# EAGLE design controller (EAGLE 4.11)
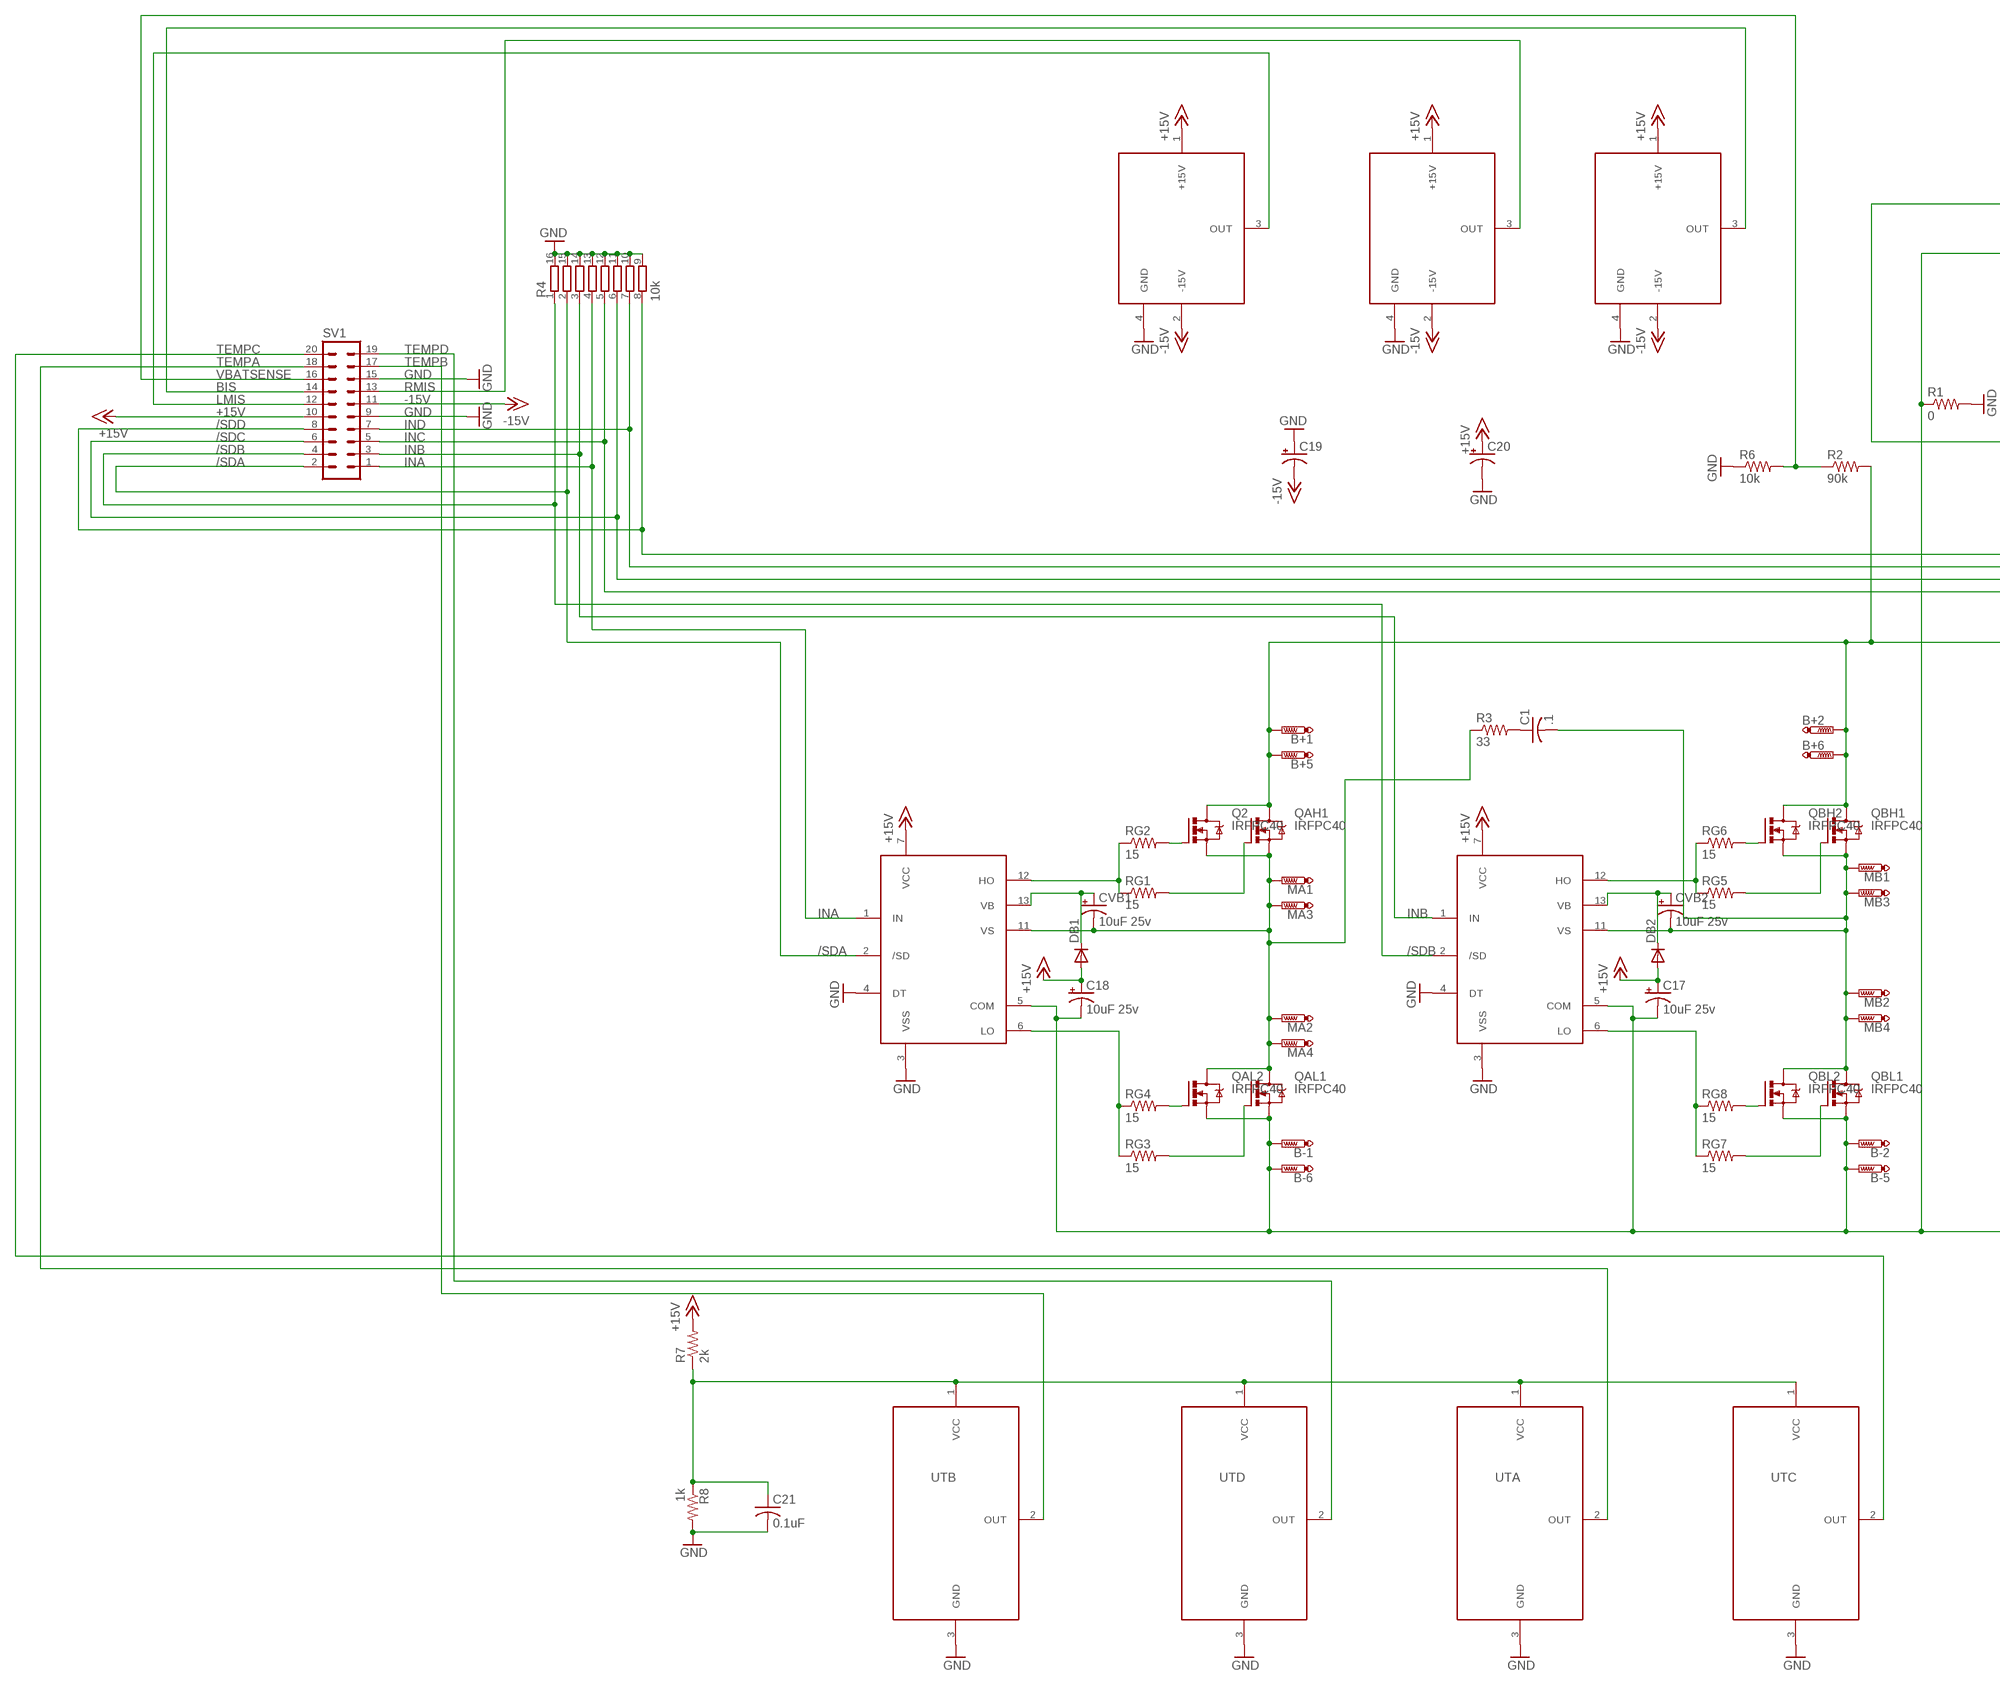
[diagram p0: schematic, sheet 1, part 1 of 2]
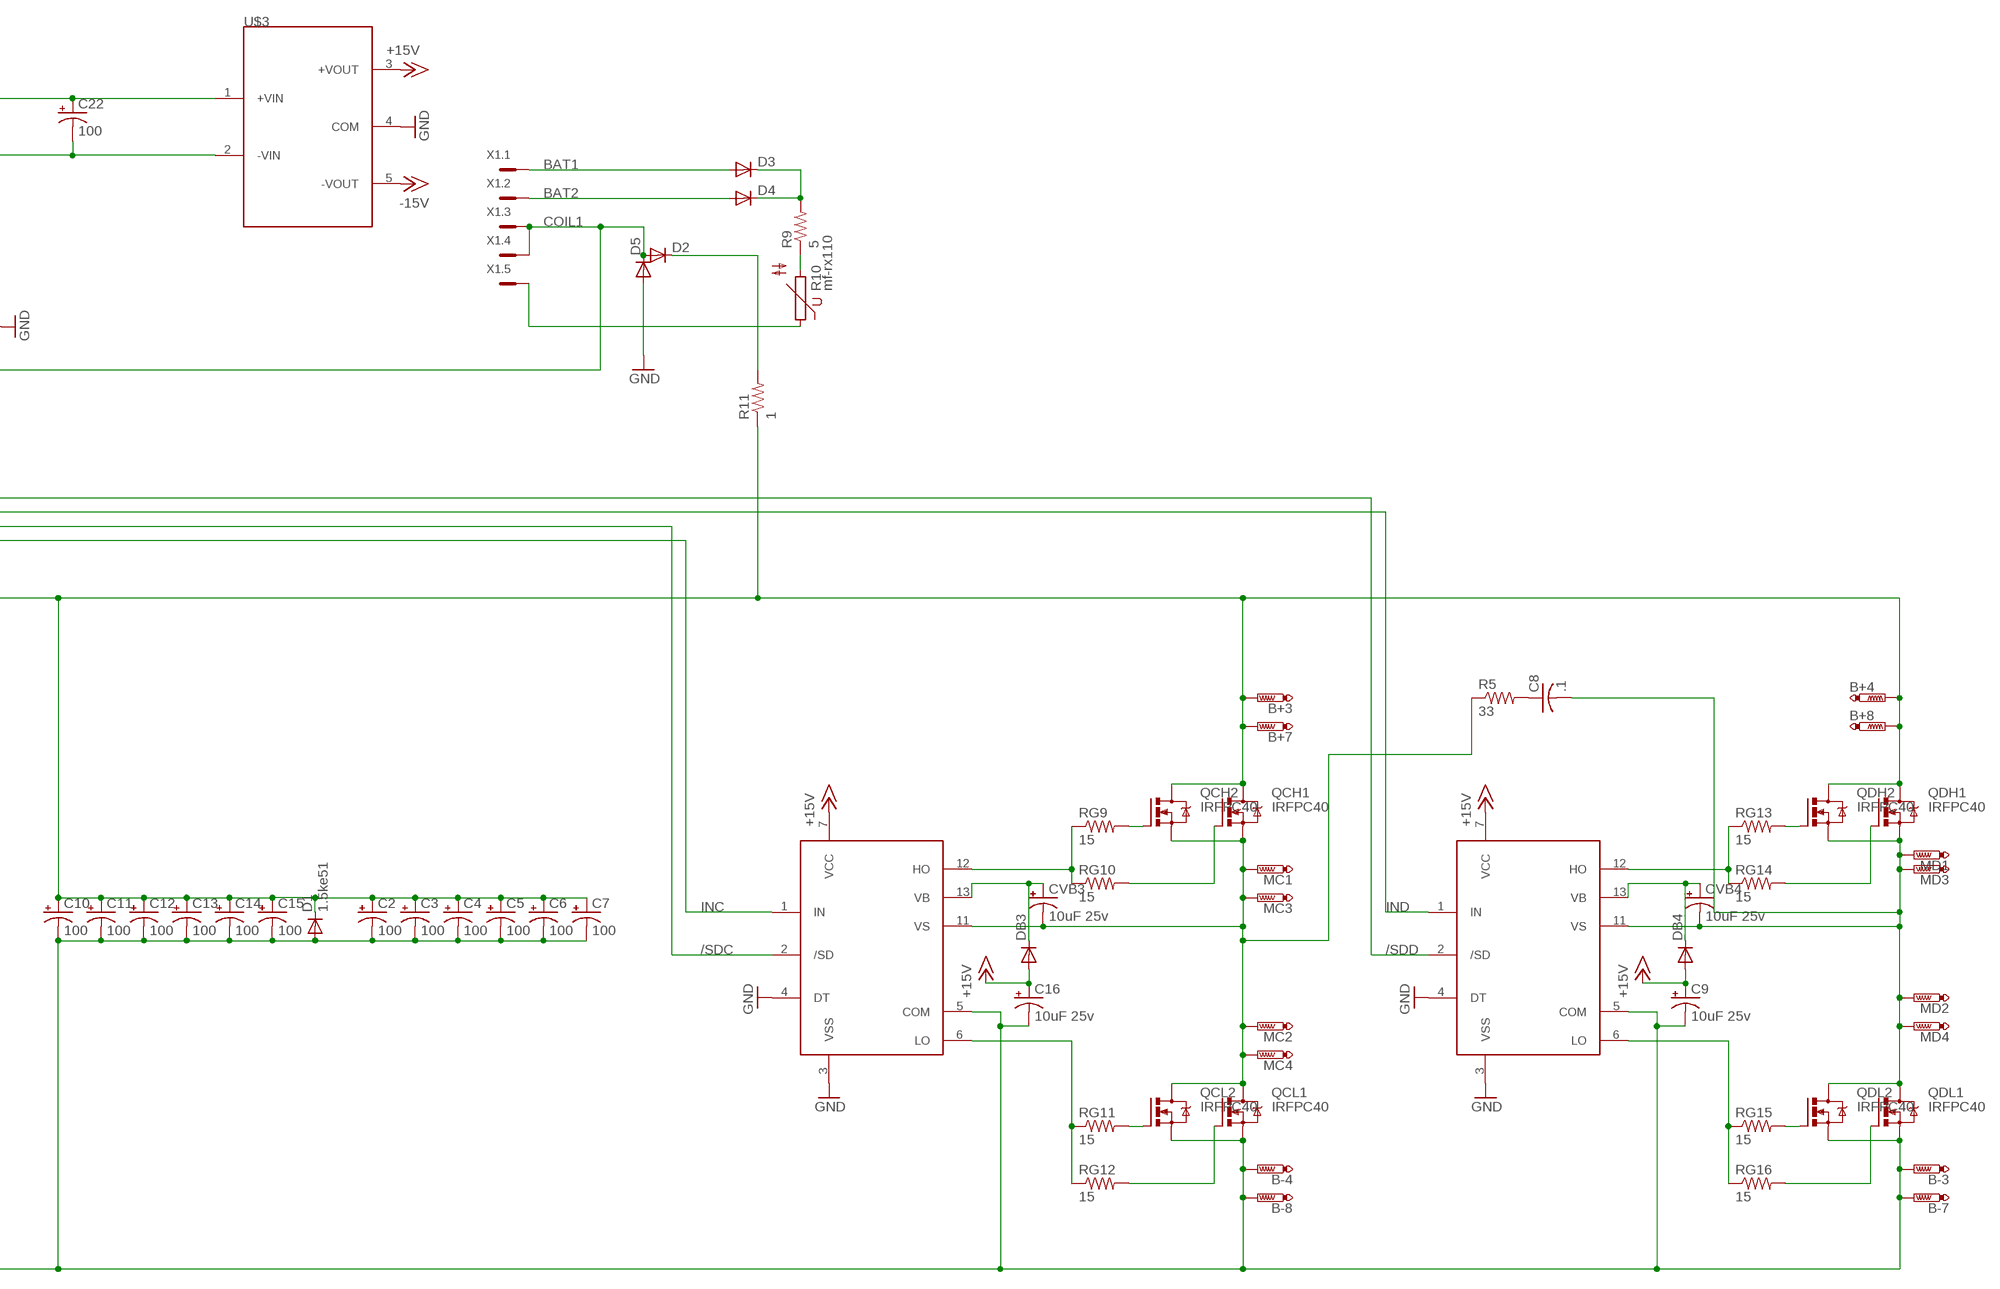
[diagram p1: schematic, sheet 1, part 2 of 2]

## Parts
B+1  PTR1PAD1-17Y  [P1-17Y]
B+2  PTR1PAD1-17Y  [P1-17Y]
B+3  PTR1PAD1-17Y  [P1-17Y]
B+4  PTR1PAD1-17Y  [P1-17Y]
B+5  PTR1PAD1-17Y  [P1-17Y]
B+6  PTR1PAD1-17Y  [P1-17Y]
B+7  PTR1PAD1-17Y  [P1-17Y]
B+8  PTR1PAD1-17Y  [P1-17Y]
B-1  PTR1PAD1-17Y  [P1-17Y]
B-2  PTR1PAD1-17Y  [P1-17Y]
B-3  PTR1PAD1-17Y  [P1-17Y]
B-4  PTR1PAD1-17Y  [P1-17Y]
B-5  PTR1PAD1-17Y  [P1-17Y]
B-6  PTR1PAD1-17Y  [P1-17Y]
B-7  PTR1PAD1-17Y  [P1-17Y]
B-8  PTR1PAD1-17Y  [P1-17Y]
C1  .1  C-US050-050X075  [C050-050X075]
C2  100  CPOL-USE2.5-7  [E2,5-7]
C3  100  CPOL-USE2.5-7  [E2,5-7]
C4  100  CPOL-USE2.5-7  [E2,5-7]
C5  100  CPOL-USE2.5-7  [E2,5-7]
C6  100  CPOL-USE2.5-7  [E2,5-7]
C7  100  CPOL-USE2.5-7  [E2,5-7]
C8  .1  C-US050-050X075  [C050-050X075]
C9  10uF 25v  CPOL-USC/6032-28R  [C/6032-28R]
C10  100  CPOL-USE2.5-7  [E2,5-7]
C11  100  CPOL-USE2.5-7  [E2,5-7]
C12  100  CPOL-USE2.5-7  [E2,5-7]
C13  100  CPOL-USE2.5-7  [E2,5-7]
C14  100  CPOL-USE2.5-7  [E2,5-7]
C15  100  CPOL-USE2.5-7  [E2,5-7]
C16  10uF 25v  CPOL-USC/6032-28R  [C/6032-28R]
C17  10uF 25v  CPOL-USC/6032-28R  [C/6032-28R]
C18  10uF 25v  CPOL-USC/6032-28R  [C/6032-28R]
C19  CPOL-USC/6032-28R  [C/6032-28R]
C20  CPOL-USC/6032-28R  [C/6032-28R]
C21  0.1uF  C-USC0805  [C0805]
C22  100  CPOL-USE2.5-7  [E2,5-7]
CVB1  10uF 25v  CPOL-USC/6032-28R  [C/6032-28R]
CVB2  10uF 25v  CPOL-USC/6032-28R  [C/6032-28R]
CVB3  10uF 25v  CPOL-USC/6032-28R  [C/6032-28R]
CVB4  10uF 25v  CPOL-USC/6032-28R  [C/6032-28R]
D1  1.5ke51  DIODE-DO201-15  [DO201-15]
D2  DIODE-DO41-10  [DO41-10]
D3  DIODE-DO41-10  [DO41-10]
D4  DIODE-DO41-10  [DO41-10]
D5  DIODE-DO41-10  [DO41-10]
DB1  DIODE-SOD323-W  [SOD323-W]
DB2  DIODE-SOD323-W  [SOD323-W]
DB3  DIODE-SOD323-W  [SOD323-W]
DB4  DIODE-SOD323-W  [SOD323-W]
DRV1  IR21844S  [14-SOIC]
DRV2  IR21844S  [14-SOIC]
DRV3  IR21844S  [14-SOIC]
DRV4  IR21844S  [14-SOIC]
MA1  PTR1PAD1-17Y  [P1-17Y]
MA2  PTR1PAD1-17Y  [P1-17Y]
MA3  PTR1PAD1-17Y  [P1-17Y]
MA4  PTR1PAD1-17Y  [P1-17Y]
MB1  PTR1PAD1-17Y  [P1-17Y]
MB2  PTR1PAD1-17Y  [P1-17Y]
MB3  PTR1PAD1-17Y  [P1-17Y]
MB4  PTR1PAD1-17Y  [P1-17Y]
MC1  PTR1PAD1-17Y  [P1-17Y]
MC2  PTR1PAD1-17Y  [P1-17Y]
MC3  PTR1PAD1-17Y  [P1-17Y]
MC4  PTR1PAD1-17Y  [P1-17Y]
MD1  PTR1PAD1-17Y  [P1-17Y]
MD2  PTR1PAD1-17Y  [P1-17Y]
MD3  PTR1PAD1-17Y  [P1-17Y]
MD4  PTR1PAD1-17Y  [P1-17Y]
Q2  IRFPC40  [TO247BV]
QAH1  IRFPC40  [TO247BV]
QAL1  IRFPC40  [TO247BV]
QAL2  IRFPC40  [TO247BV]
QBH1  IRFPC40  [TO247BV]
QBH2  IRFPC40  [TO247BV]
QBL1  IRFPC40  [TO247BV]
QBL2  IRFPC40  [TO247BV]
QCH1  IRFPC40  [TO247BV]
QCH2  IRFPC40  [TO247BV]
QCL1  IRFPC40  [TO247BV]
QCL2  IRFPC40  [TO247BV]
QDH1  IRFPC40  [TO247BV]
QDH2  IRFPC40  [TO247BV]
QDL1  IRFPC40  [TO247BV]
QDL2  IRFPC40  [TO247BV]
R1  0  R-US_R0805  [R0805]
R2  90k  R-US_R0805  [R0805]
R3  33  R-US_0414/15  [0414/15]
R4  10k  4816P-T01  [4816P]
R5  33  R-US_0414/15  [0414/15]
R6  10k  R-US_R0805  [R0805]
R7  2k  R-US_R0805  [R0805]
R8  1k  R-US_R0805  [R0805]
R9  5  R-US_0414/15  [0414/15]
R10  mf-rx110  S05K40  [S05K40]
R11  1  R-US_0414/15  [0414/15]
RG1  15  R-US_R0805  [R0805]
RG2  15  R-US_R0805  [R0805]
RG3  15  R-US_R0805  [R0805]
RG4  15  R-US_R0805  [R0805]
RG5  15  R-US_R0805  [R0805]
RG6  15  R-US_R0805  [R0805]
RG7  15  R-US_R0805  [R0805]
RG8  15  R-US_R0805  [R0805]
RG9  15  R-US_R0805  [R0805]
RG10  15  R-US_R0805  [R0805]
RG11  15  R-US_R0805  [R0805]
RG12  15  R-US_R0805  [R0805]
RG13  15  R-US_R0805  [R0805]
RG14  15  R-US_R0805  [R0805]
RG15  15  R-US_R0805  [R0805]
RG16  15  R-US_R0805  [R0805]
SV1  MA10-2  [MA10-2]
U$1  L08P150D15  [L08P]
U$2  L08P150D15  [L08P]
U$3  DFC10U48D15  [DFC10]
U$5  L08P150D15  [L08P]
UTA  LM61BIM  [SOT23]
UTB  LM61BIM  [SOT23]
UTC  LM61BIM  [SOT23]
UTD  LM61BIM  [SOT23]
X1  MC5  [MC5]

## Nets
+15V [pwr]: C9.+ C16.+ C17.+ C18.+ C20.+ DB1.A DB2.A DB3.A DB4.A DRV1.7(VCC) DRV2.7(VCC) DRV3.7(VCC) DRV4.7(VCC) R7.2 SV1.10 U$1.1(+15V) U$2.1(+15V) U$3.3(+VOUT) U$5.1(+15V)
-15V [pwr]: C19.- SV1.11 U$1.2(-15V) U$2.2(-15V) U$3.5(-VOUT) U$5.2(-15V)
/SDA: DRV1.2(/SD) R4.2 SV1.2
/SDB: DRV2.2(/SD) R4.1 SV1.4
/SDC: DRV3.2(/SD) R4.6 SV1.6
/SDD: DRV4.2(/SD) R4.8 SV1.8
B+ [highpwr]: B+1.1(TP) B+2.1(TP) B+3.1(TP) B+4.1(TP) B+5.1(TP) B+6.1(TP) B+7.1(TP) B+8.1(TP) C2.+ C3.+ C4.+ C5.+ C6.+ C7.+ C10.+ C11.+ C12.+ C13.+ C14.+ C15.+ D1.C Q2.D QAH1.D QBH1.D QBH2.D QCH1.D QCH2.D QDH1.D QDH2.D R2.2 R11.1
B- [highpwr]: B-1.1(TP) B-2.1(TP) B-3.1(TP) B-4.1(TP) B-5.1(TP) B-6.1(TP) B-7.1(TP) B-8.1(TP) C2.- C3.- C4.- C5.- C6.- C7.- C9.- C10.- C11.- C12.- C13.- C14.- C15.- C16.- C17.- C18.- C22.- D1.A DRV1.5(COM) DRV2.5(COM) DRV3.5(COM) DRV4.5(COM) QAL1.S QAL2.S QBL1.S QBL2.S QCL1.S QCL2.S QDL1.S QDL2.S R1.1 U$3.2(-VIN)
BAT1 [highsig]: D3.A X1.1
BAT2 [highsig]: D4.A X1.2
BIS: SV1.14 U$5.3(OUT)
COIL1 [highpwr]: C22.+ D2.A D5.C U$3.1(+VIN) X1.3 X1.4
GAH [highsig]: DRV1.12(HO) RG1.1 RG2.1
GAH1 [highsig]: DRV3.12(HO) RG9.1 RG10.1
GAL [highsig]: DRV1.6(LO) RG3.1 RG4.1
GAL1 [highsig]: DRV3.6(LO) RG11.1 RG12.1
GBH [highsig]: DRV2.12(HO) RG5.1 RG6.1
GBH1 [highsig]: DRV4.12(HO) RG13.1 RG14.1
GBL [highsig]: DRV2.6(LO) RG7.1 RG8.1
GBL1 [highsig]: DRV4.6(LO) RG15.1 RG16.1
GND [pwr]: C19.+ C20.- C21.2 D5.A DRV1.3(VSS) DRV1.4(DT) DRV2.3(VSS) DRV2.4(DT) DRV3.3(VSS) DRV3.4(DT) DRV4.3(VSS) DRV4.4(DT) R1.2 R4.9 R4.10 R4.11 R4.12 R4.13 R4.14 R4.15 R4.16 R6.1 R8.2 SV1.9 SV1.15 U$1.4(GND) U$2.4(GND) U$3.4(COM) U$5.4(GND) UTA.3(GND) UTB.3(GND) UTC.3(GND) UTD.3(GND)
INA: DRV1.1(IN) R4.4 SV1.1
INB: DRV2.1(IN) R4.3 SV1.3
INC: DRV3.1(IN) R4.5 SV1.5
IND: DRV4.1(IN) R4.7 SV1.7
LM61PWR: C21.1 R7.1 R8.1 UTA.1(VCC) UTB.1(VCC) UTC.1(VCC) UTD.1(VCC)
LMIS: SV1.12 U$1.3(OUT)
MA1 [highpwr]: CVB3.- DRV3.11(VS) MC1.1(TP) MC2.1(TP) MC3.1(TP) MC4.1(TP) QCH1.S QCH2.S QCL1.D QCL2.D R5.1
MB [highpwr]: C1.2 CVB2.- DRV2.11(VS) MB1.1(TP) MB2.1(TP) MB3.1(TP) MB4.1(TP) QBH1.S QBH2.S QBL1.D QBL2.D
MB1 [highpwr]: C8.2 CVB4.- DRV4.11(VS) MD1.1(TP) MD2.1(TP) MD3.1(TP) MD4.1(TP) QDH1.S QDH2.S QDL1.D QDL2.D
N$1 [highpwr]: D2.C R11.2
N$2: C1.1 R3.2
N$4: C8.1 R5.2
N$7 [highsig]: R9.1 R10.2
N$8 [highsig]: D3.C D4.C R9.2
N$10 [highpwr]: R10.1 X1.5
Q1G [highsig]: QAH1.G RG1.2
Q1G1 [highsig]: QCH1.G RG10.2
Q2G [highsig]: Q2.G RG2.2
Q2G1 [highsig]: QCH2.G RG9.2
Q3G [highsig]: QAL1.G RG3.2
Q3G1 [highsig]: QCL1.G RG12.2
Q4G [highsig]: QAL2.G RG4.2
Q4G1 [highsig]: QCL2.G RG11.2
Q5G [highsig]: QBH1.G RG5.2
Q5G1 [highsig]: QDH1.G RG14.2
Q6G [highsig]: QBH2.G RG6.2
Q6G1 [highsig]: QDH2.G RG13.2
Q7G [highsig]: QBL1.G RG7.2
Q7G1 [highsig]: QDL1.G RG16.2
Q8G [highsig]: QBL2.G RG8.2
Q8G1 [highsig]: QDL2.G RG15.2
QAH2 [highpwr]: CVB1.- DRV1.11(VS) MA1.1(TP) MA2.1(TP) MA3.1(TP) MA4.1(TP) Q2.S QAH1.S QAL1.D QAL2.D R3.1
RMIS: SV1.13 U$2.3(OUT)
TEMPA: SV1.18 UTA.2(OUT)
TEMPB: SV1.17 UTB.2(OUT)
TEMPC: SV1.20 UTC.2(OUT)
TEMPD: SV1.19 UTD.2(OUT)
VB1 [pwr]: CVB1.+ DB1.C DRV1.13(VB)
VB2 [pwr]: CVB2.+ DB2.C DRV2.13(VB)
VB3 [pwr]: CVB3.+ DB3.C DRV3.13(VB)
VB4 [pwr]: CVB4.+ DB4.C DRV4.13(VB)
VBATSENSE: R2.1 R6.2 SV1.16

## Library data of the parts
B+1-B+8 B-1-B-8 MA1-MA4 MB1-MB4 MC1-MC4 MD1-MD4 = testpad:PTR1: TEST PIN
C1 C8 C21 = rcl:C-US: CAPACITOR, American symbol
C2-C7 C9-C20 C22 CVB1-CVB4 = rcl:CPOL-US: POLARIZED CAPACITOR, American symbol
D1-D5 DB1-DB4 = diode:DIODE-: DIODE
DRV1-DRV4 = tlb:IR21844S
Q2 QAH1 QAL1 QAL2 QBH1 QBH2 QBL1 QBL2 QCH1 QCH2 QCL1 QCL2 QDH1 QDH2 QDL1 QDL2 = transistor-power:IRFPC40: N-CHANNEL MOS FET
R1-R3 R5-R9 R11 RG1-RG16 = rcl:R-US_: RESISTOR, American symbol
R4 = resistor-bourns:4816P-T01: BOURNS RESISTOR NETWORK
R10 = varistor:S05K40: VARISTOR
SV1 = con-lstb:MA10-2: PIN HEADER
U$1 U$2 U$5 = tlb:L08P150D15
U$3 = tlb:DFC10U48D15
UTA UTB UTC UTD = tlb:LM61BIM
X1 = con-phoenix-381_l:MC5: Mini-Combicon 3.81mm horizontal 5-polig (ohne Gegenstecker)

## Net classes
0 default: width 0.203 mm
1 highpwr: width 0.61 mm, clearance 0.813 mm
2 highsig: width 0.406 mm, clearance 0.61 mm
3 pwr: width 0.61 mm, clearance 0.61 mm

## Board
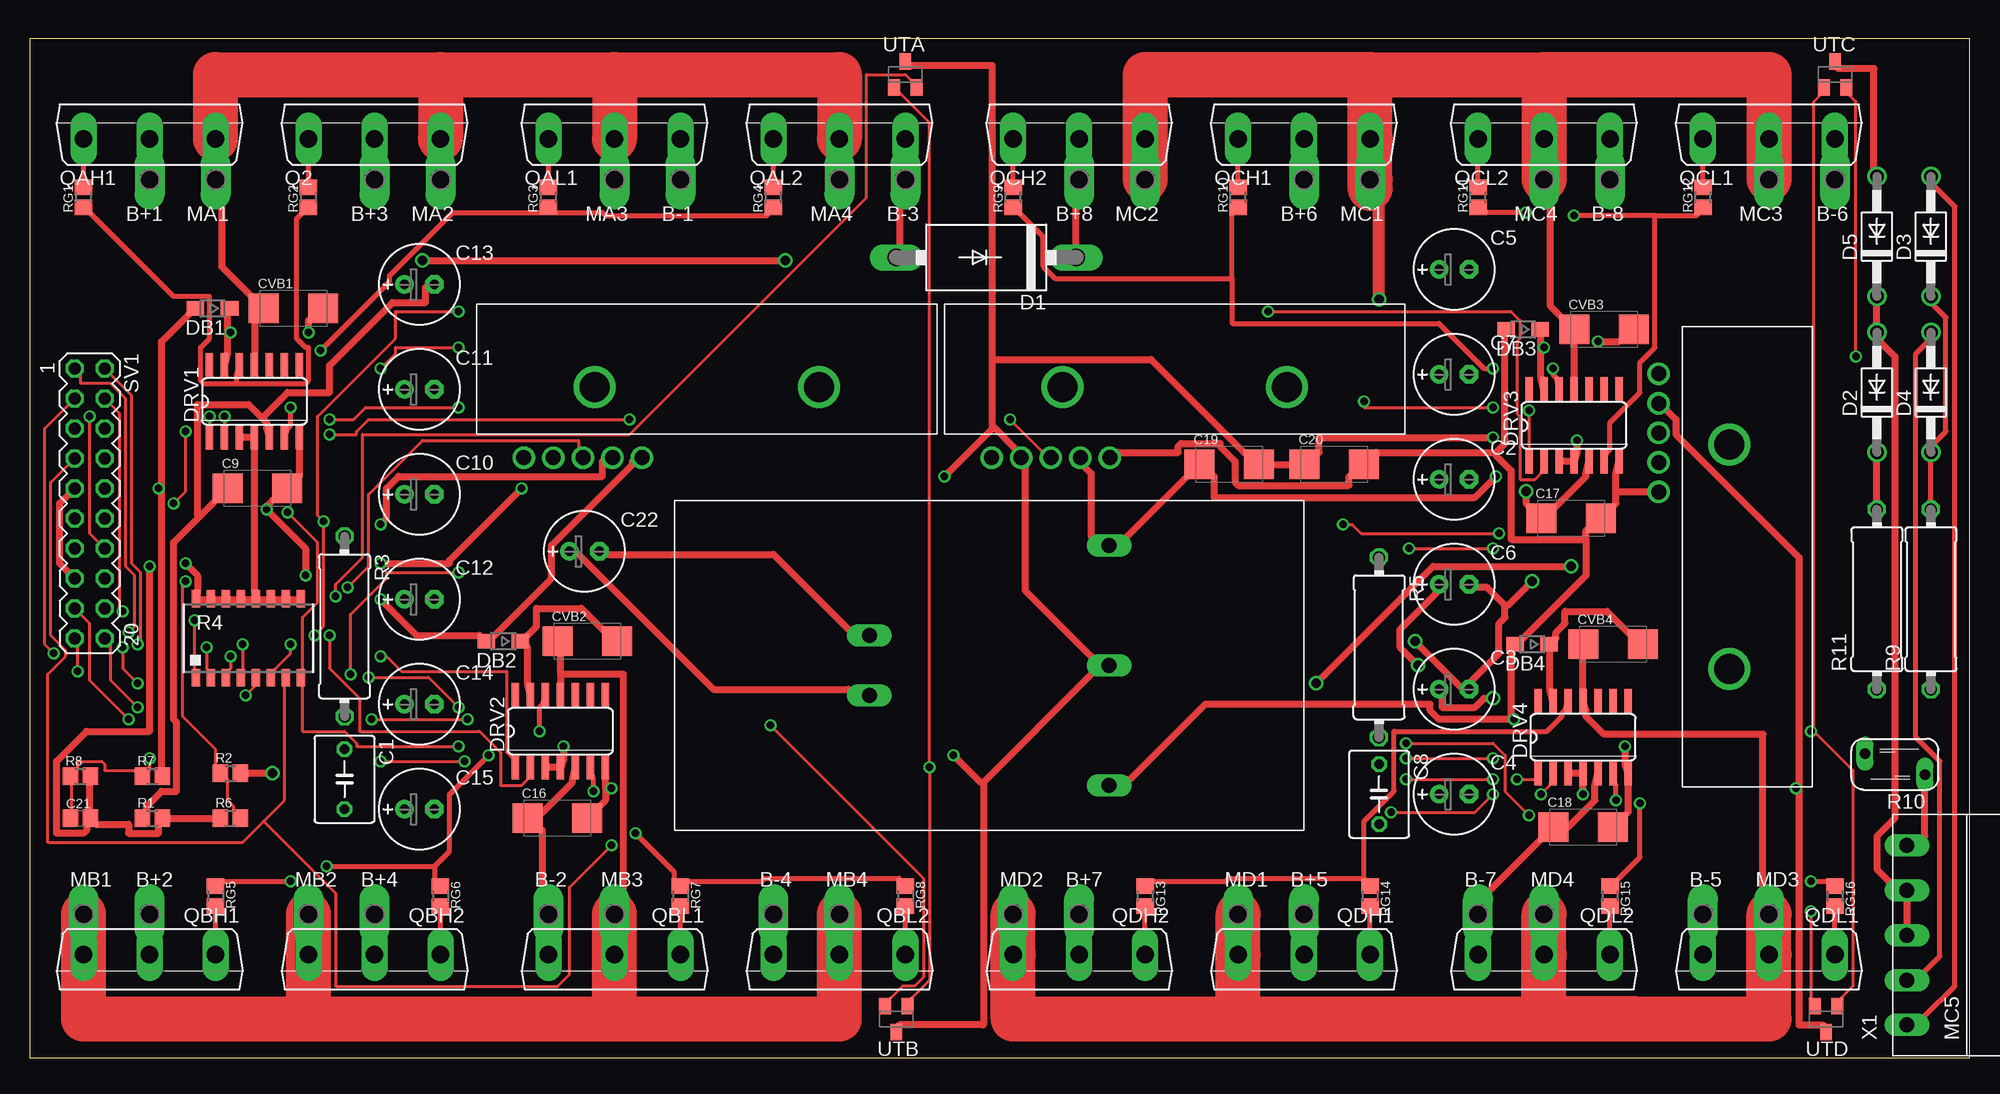
[diagram p2: board, top side]
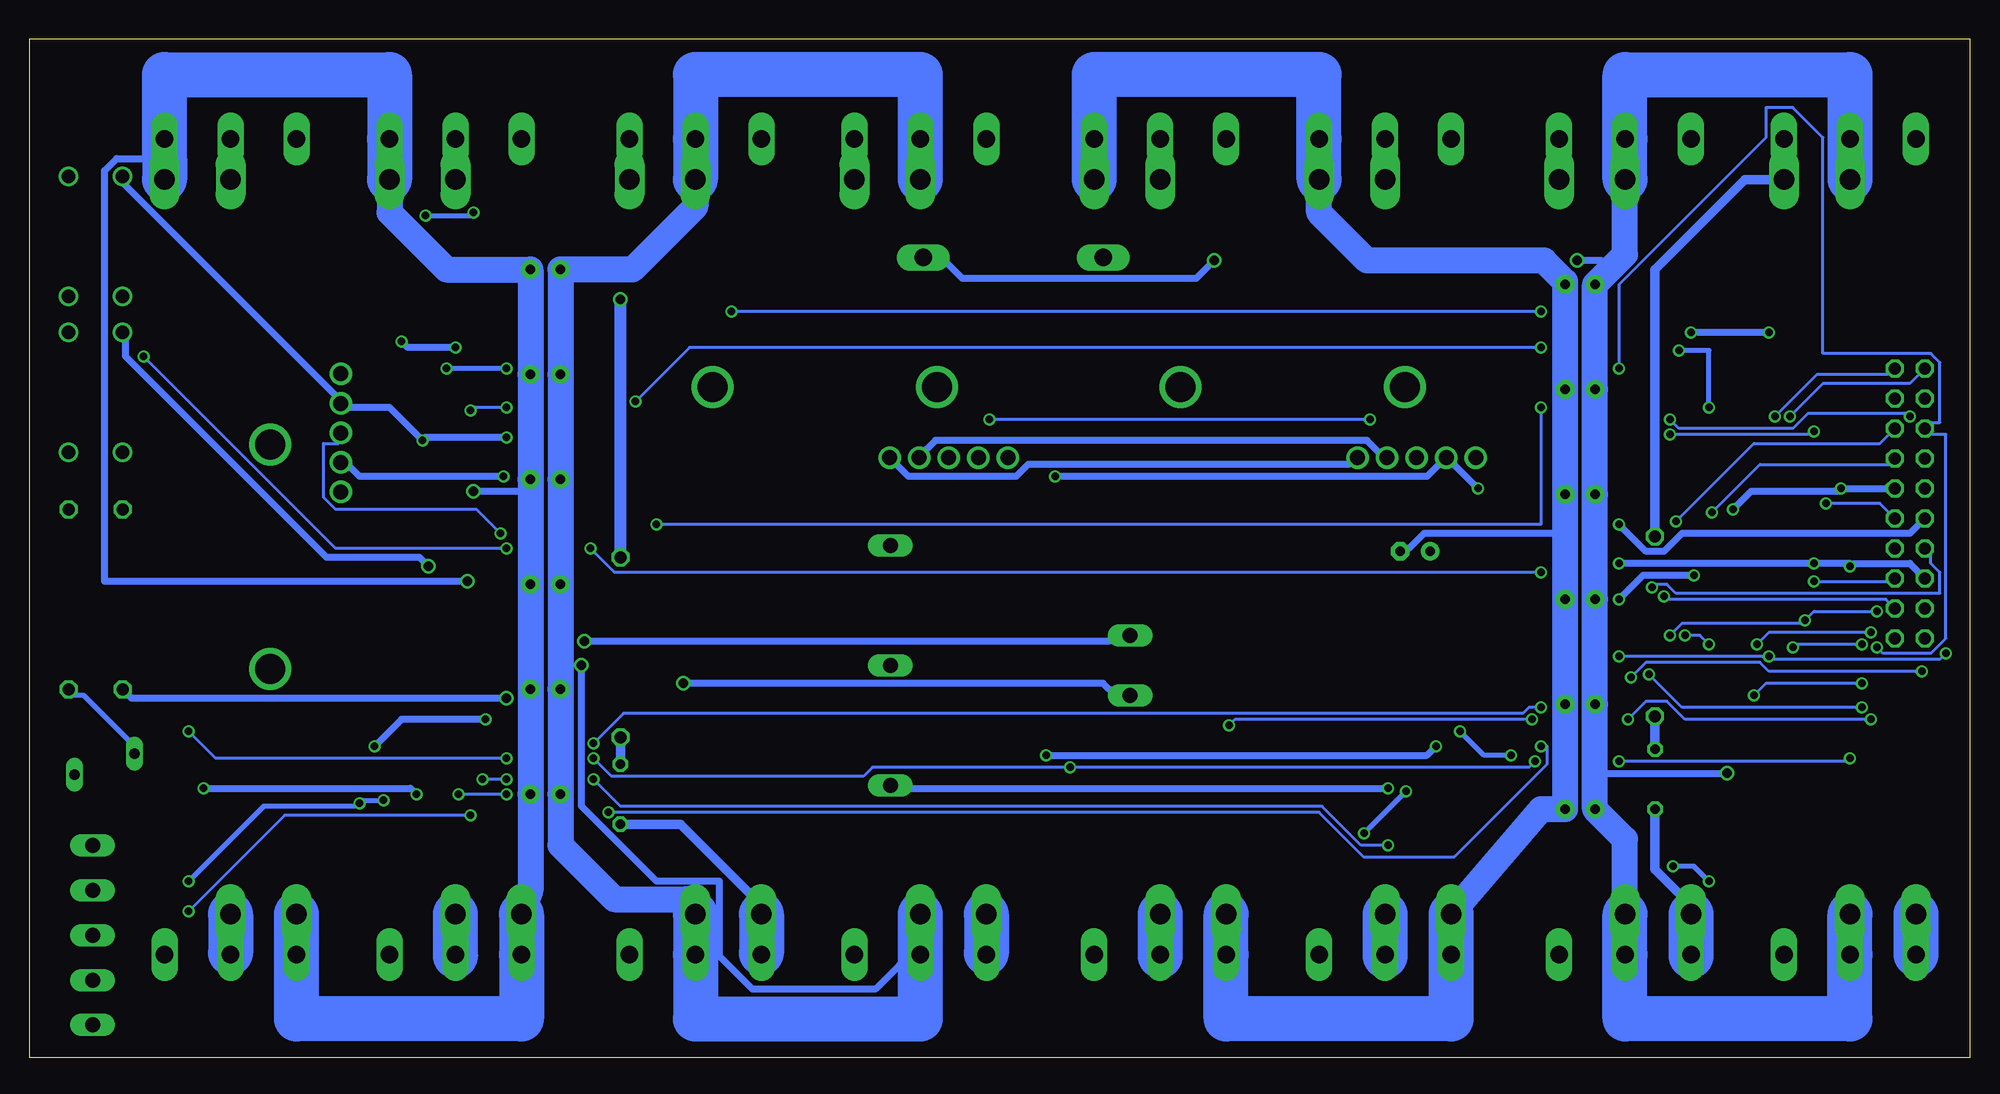
[diagram p3: board, bottom side, seen from below]

Size 164.34 x 86.36 mm. Coordinates in mm from the lower left corner, seen from the top.
Outline: 0,0 164.34,0 164.34,86.36 0,86.36 0,0
Copper layers (1*16): Top 0.035mm / dielectric 1.5mm / Bottom 0.035mm
Design rules "default": minimum track width 10mil, minimum drill 24mil, track to track 8mil, track to pad 8mil, pad to pad 8mil, via to via 8mil, smd to smd 8mil, copper to edge 40mil, drill to drill 8mil, minimum pad ring 10mil, minimum via ring 8mil, stop-mask expansion 4mil, vias tented up to drill 0mil, thermal gap 10mil

### Footprints (pad centres in the part's own frame; a part is rotated, then mirrored left to right if it is on the bottom)
P1-17Y = drill 1.702 pad 2.121 long: 1 0,0
C050-050X075 = drill 0.813 octagon: 1 -2.54,0; 2 2.54,0
E2,5-7 = drill 0.813 pad 1.6 round: + -1.27,0 | drill 0.813 pad 1.6 octagon: - 1.27,0
C/6032-28R = smd 2.55 x 2.5: + 2.525,0; - -2.525,0
C0805 = smd 1.3 x 1.5: 1 -0.85,0; 2 0.85,0
DO201-15 = drill 1.499 long: A 7.62,0; C -7.62,0
DO41-10 = drill 1.118 round: A 5.08,0; C -5.08,0
SOD323-W = smd 1.5 x 1.2: A 1.45,0; C -1.45,0
14-SOIC = smd 0.66 x 2.032: 1 -3.81,-3.073; 2 -2.54,-3.073; 3 -1.27,-3.073; 4 0,-3.073; 5 1.27,-3.073; 6 2.54,-3.073; 7 3.81,-3.073; 8 3.81,3.073; 9 2.54,3.073; 10 1.27,3.073; 11 0,3.073; 12 -1.27,3.073; 13 -2.54,3.073; 14 -3.81,3.073
TO247BV = drill 1.499 long: D 0,-2.921; G -5.588,-2.921; S 5.588,-2.921
R0805 = smd 1.3 x 1.5: 1 -0.85,0; 2 0.85,0
0414/15 = drill 1.016 octagon: 1 -7.62,0; 2 7.62,0
4816P = smd 0.7 x 1.5: 1 -4.445,-3.346; 2 -3.175,-3.346; 3 -1.905,-3.346; 4 -0.635,-3.346; 5 0.635,-3.346; 6 1.905,-3.346; 7 3.175,-3.346; 8 4.445,-3.346; 9 4.445,3.346; 10 3.175,3.346; 11 1.905,3.346; 12 0.635,3.346; 13 -0.635,3.346; 14 -1.905,3.346; 15 -3.175,3.346; 16 -4.445,3.346
S05K40 = drill 0.914 long: 1 -0.889,-2.54; 2 0.889,2.54
MA10-2 = drill 1.016 octagon: 1 -11.43,-1.27; 2 -11.43,1.27; 3 -8.89,-1.27; 4 -8.89,1.27; 5 -6.35,-1.27; 6 -6.35,1.27; 7 -3.81,-1.27; 8 -3.81,1.27; 9 -1.27,-1.27; 10 -1.27,1.27; 11 1.27,-1.27; 12 1.27,1.27; 13 3.81,-1.27; 14 3.81,1.27; 15 6.35,-1.27; 16 6.35,1.27; 17 8.89,-1.27; 18 8.89,1.27; 19 11.43,-1.27; 20 11.43,1.27
L08P = drill 1.27 round: 1 -3,-3; 2 -5.5,-3; 3 -8,-3; 4 -10.5,-3; 5 -13,-3 | drill 2.54 round: P$6 -7,3; P$7 12,3
DFC10 = drill 1.27 long: 1 0,-2.54; 2 0,2.54; 3 20.32,-10.16; 4 20.32,0; 5 20.32,10.16
SOT23 = smd 1 x 1.4: 1 -0.95,-1.1; 2 0.95,-1.1; 3 0,1.1
MC5 = drill 1.27 long: 1 -7.62,0; 2 -3.81,0; 3 0,0; 4 3.81,0; 5 7.62,0

### Placement (x,y rotation side)
B+1  10.16,74.42 180 top
B+2  10.16,12.19 0 top
B+3  29.21,74.42 180 top
B+4  29.21,12.19 0 top
B+5  107.95,12.19 0 top
B+6  107.95,74.42 180 top
B+7  88.9,12.19 0 top
B+8  88.9,74.42 180 top
B-1  55.12,74.42 180 top
B-2  43.94,12.19 0 top
B-3  74.17,74.42 180 top
B-4  62.99,12.19 0 top
B-5  141.73,12.19 0 top
B-6  152.91,74.42 180 top
B-7  122.68,12.19 0 top
B-8  133.86,74.42 180 top
C1  26.67,23.62 270 top
C2  120.65,49.02 0 top
C3  120.65,31.24 0 top
C4  120.65,22.35 0 top
C5  120.65,66.8 0 top
C6  120.65,40.13 0 top
C7  120.65,57.91 0 top
C8  114.3,22.35 270 top
C9  19.3,48.26 0 top
C10  33.02,47.75 0 top
C11  33.02,56.64 0 top
C12  33.02,38.86 0 top
C13  33.02,65.53 0 top
C14  33.02,29.97 0 top
C15  33.02,21.08 0 top
C16  44.7,20.32 0 top
C17  130.56,45.72 0 top
C18  131.57,19.56 0 top
C19  101.6,50.29 0 top
C20  110.49,50.29 0 top
C21  4.32,20.32 0 top
C22  46.99,42.93 0 top
CVB1  22.35,63.5 0 top
CVB2  47.24,35.31 0 top
CVB3  133.35,61.72 0 top
CVB4  134.11,35.05 0 top
D1  81.03,67.82 180 top
D2  156.46,56.39 90 top
D3  161.04,69.6 90 top
D4  161.04,56.39 90 top
D5  156.46,69.6 90 top
DB1  15.49,63.5 180 top
DB2  40.13,35.31 180 top
DB3  126.49,61.72 180 top
DB4  127.25,35.05 180 top
DRV1  19.05,55.63 0 top
DRV2  44.96,27.69 0 top
DRV3  130.81,53.59 0 top
DRV4  131.57,27.18 0 top
MA1  15.75,74.42 180 top
MA2  34.8,74.42 180 top
MA3  49.53,74.42 180 top
MA4  68.58,74.42 180 top
MB1  4.57,12.19 0 top
MB2  23.62,12.19 0 top
MB3  49.53,12.19 0 top
MB4  68.58,12.19 0 top
MC1  113.54,74.42 180 top
MC2  94.49,74.42 180 top
MC3  147.32,74.42 180 top
MC4  128.27,74.42 180 top
MD1  102.36,12.19 0 top
MD2  83.31,12.19 0 top
MD3  147.32,12.19 0 top
MD4  128.27,12.19 0 top
Q2  29.21,80.77 0 top
QAH1  10.16,80.77 0 top
QAL1  49.53,80.77 0 top
QAL2  68.58,80.77 0 top
QBH1  10.16,5.84 180 top
QBH2  29.21,5.84 180 top
QBL1  49.53,5.84 180 top
QBL2  68.58,5.84 180 top
QCH1  107.95,80.77 0 top
QCH2  88.9,80.77 0 top
QCL1  147.32,80.77 0 top
QCL2  128.27,80.77 0 top
QDH1  107.95,5.84 180 top
QDH2  88.9,5.84 180 top
QDL1  147.32,5.84 180 top
QDL2  128.27,5.84 180 top
R1  10.41,20.32 0 top
R2  17.02,24.13 0 top
R3  26.67,36.58 270 top
R4  18.54,35.56 0 top
R5  114.3,34.8 270 top
R6  17.02,20.32 0 top
R7  10.41,23.88 0 top
R8  4.32,23.88 0 top
R9  161.04,38.86 90 top
R10  157.99,24.89 90 top
R11  156.46,38.86 90 top
RG1  4.57,72.9 90 top
RG2  23.62,72.9 90 top
RG3  43.94,72.9 90 top
RG4  62.99,72.9 90 top
RG5  15.75,13.72 270 top
RG6  34.8,13.72 270 top
RG7  55.12,13.72 270 top
RG8  74.17,13.72 270 top
RG9  83.31,72.9 90 top
RG10  102.36,72.9 90 top
RG11  122.68,72.9 90 top
RG12  141.73,72.9 90 top
RG13  94.49,13.72 270 top
RG14  113.54,13.72 270 top
RG15  133.86,13.72 270 top
RG16  152.91,13.72 270 top
SV1  5.08,46.99 270 top
U$1  94.49,53.85 0 top
U$2  54.86,53.85 0 top
U$3  71.12,33.27 0 top
U$5  140.97,44.96 270 top
UTA  74.17,83.31 0 top
UTB  73.41,3.3 180 top
UTC  152.91,83.31 0 top
UTD  152.15,3.3 180 top
X1  159,10.41 90 top

### Tracks (layer width: path | path; a pad name or v marks a point on that pad's centre or on a via)
+15V  (via drill 0.61)
  Top 0.61: C18.+ 135.13,20.57 135.38,20.83 DRV4.7 135.13,24.89 v135.13,26.42 | 48.77,22.86 48.77,21.84 48.26,21.34 C16.+ | 48.77,22.86 DRV2.7 | 131.83,43.94 131.83,44.7 C17.+ 134.11,46.74 134.37,46.99 134.37,48.01 | 131.83,43.94 131.83,40.89 126.49,35.56 DB4.A 125.48,34.54 125.48,28.7 | 134.37,48.01 134.37,49.53 DRV3.7 | 125.48,28.7 119.38,28.7 118.62,29.46 118.62,29.97 99.57,29.97 93.22,23.62 U$3.3 | U$5.1 137.16,48.01 134.37,48.01 | v49.28,22.86 48.77,22.86 | 125.48,28.7 v125.73,28.7 | DRV1.7 22.86,49.28 C9.+ 20.57,47.24 20.07,46.74 v20.07,46.48 23.37,43.18 v23.37,40.89 | 11.18,48.26 11.18,60.71 13.46,62.99 DB1.A | 11.18,48.26 11.18,24.38 R7.2 | 11.18,48.26 v10.92,48.26 | U$2.1 51.05,50.55 51.05,50.29 44.2,43.43 44.2,40.64 39.37,35.81 DB2.A 38.1,35.81 32.77,35.81 v29.72,38.86 | 124.21,51.31 124.97,52.07 124.97,61.21 DB3.A | 124.21,51.31 114.05,51.31 C20.+ 111.76,49.28 111.76,48.51 102.36,48.51 102.11,48.77 102.11,50.55 100.84,51.82 100.84,52.07 97.54,52.07 97.28,51.82 97.28,51.31 92.2,51.31 U$1.1 | 131.83,43.94 125.48,43.94 125.48,49.78 124.21,51.05 124.21,51.31
  Bottom 0.61: v49.28,22.86 89.66,22.86 U$3.3 | v135.13,26.42 132.84,28.7 v125.73,28.7 | SV1.10 v10.92,48.26 11.18,48.01 18.54,48.01 v20.07,46.48 | U$2.1 52.58,50.29 79.76,50.29 80.77,49.28 89.92,49.28 U$1.1 | v23.37,40.89 27.69,40.89 v29.72,38.86
-15V  (via drill 0.61)
  Top 0.61: v29.72,45.21 30.23,45.72 30.23,48.26 31.24,49.28 48.51,49.28 48.51,50.55 U$2.2 | U$1.2 89.41,50.04 89.92,49.53 89.92,44.2 U$3.5 92.96,44.2 98.04,49.28 C19.- 100.33,49.28 100.33,47.5 122.43,47.5 v124.21,49.28
  Bottom 0.61: v29.72,45.21 27.43,42.93 25.91,42.93 24.38,44.45 5.08,44.45 SV1.11 | v124.21,49.28 136.4,49.28 137.16,50.04 U$5.2 | U$2.2 50.04,51.31 51.05,52.32 87.63,52.32 88.39,51.56 U$1.2
/SDA  (via drill 0.61)
  Top 0.254: v14.99,34.8 14.99,33.02 15.24,32.77 R4.2 | v9.14,35.05 9.4,35.31 9.4,41.15 8.64,41.91 8.64,56.13 SV1.2 | v16.51,54.36 DRV1.2
  Bottom 0.254: v14.99,34.8 14.73,35.05 v9.14,35.05 | v16.51,54.36 12.95,57.91 6.86,57.91 SV1.2
/SDB  (via drill 0.61)
  Top 0.254: v13.97,37.08 13.97,32.77 R4.1 | v7.87,37.85 7.62,38.1 7.62,54.61 SV1.4 | v25.4,35.81 25.4,33.02 27.94,30.48 27.94,27.69 38.1,27.69 39.88,25.91 39.88,23.11 41.66,23.11 42.16,23.62 DRV2.2
  Bottom 0.254: v7.87,37.85 13.21,37.85 v13.97,37.08 14.22,36.83 24.38,36.83 v25.4,35.81
/SDC  (via drill 0.61)
  Top 0.254: v22.1,35.05 22.1,34.29 20.57,32.77 R4.6 | v24.13,35.81 24.89,36.58 v24.89,45.47 24.38,45.97 24.38,54.36 30.99,60.96 30.99,63.25 v36.32,63.25 | v104.9,63.25 125.48,63.25 126.24,62.48 126.24,60.96 125.98,60.71 125.98,54.61 126.24,54.36 126.24,49.02 127.51,49.02 128.02,49.53 DRV3.2
  Bottom 0.254: v22.1,35.05 22.86,35.81 v24.13,35.81 | v24.89,45.47 18.29,52.07 7.62,52.07 SV1.6 | v36.32,63.25 v104.9,63.25
/SDD  (via drill 0.61)
  Top 0.254: v21.84,46.23 24.38,43.69 24.38,38.61 23.11,37.34 23.11,32.77 R4.8 23.11,31.5 23.11,27.69 26.67,27.69 27.69,26.67 27.69,26.42 v36.32,26.42 | v128.02,22.35 128.78,23.11 DRV4.2 | v123.95,22.35 122.43,20.83 v115.32,20.83
  Bottom 0.254: v21.84,46.23 17.78,50.29 6.86,50.29 SV1.8 | v123.95,22.35 v128.02,22.35 | v115.32,20.83 55.12,20.83 51.31,17.02 43.69,17.02 35.81,24.89 35.81,26.42 v36.32,26.42
B+  (via drill 0.81)
  Top 0.61: v20.57,24.13 R2.2 | v123.95,30.48 123.19,30.48 122.43,29.72 119.63,29.72 119.63,30.48 C3.+ | D1.C 88.65,71.88 B+8.1 | v33.27,67.56 v64.01,67.56 | v117.6,33.27 116.08,34.8 116.08,36.32 119.13,39.37 C6.+
  Bottom 0.61: 31.75,24.13 v20.57,24.13 | v123.95,30.48 155.7,30.48 R11.1 | v33.27,67.56 31.24,67.56 30.48,66.8 | v64.01,67.56 65.53,66.04 85.34,66.04 86.61,67.31 D1.C | v117.6,33.27 117.6,21.34 111.25,14.99 105.92,14.99 105.92,8.64 103.12,5.84 92.71,5.84 90.68,7.87 88.9,7.87
  Bottom 2.184: C11.+ C13.+ 30.48,66.8 29.21,68.07 B+3.1 | C12.+ C14.+ 31.75,24.13 C15.+ 29.21,18.54 B+4.1 | C12.+ C10.+ | C10.+ C11.+ | C5.+ 113.28,66.8 107.95,72.14 B+6.1 | B+5.1 108.71,13.46 114.81,13.46 119.38,18.03 C4.+ C3.+ C2.+ C7.+ | C5.+ C7.+ | C5.+ C7.+ | C10.+ C11.+ | C12.+ C10.+
  Bottom 3.81: B+1.1 QAH1.D 10.16,83.31 29.21,83.31 Q2.D B+3.1 | B+5.1 QDH1.D 107.95,3.3 88.9,3.3 88.9,7.87 QDH2.D B+7.1 | B+2.1 QBH1.D 10.16,3.3 29.21,3.3 QBH2.D B+4.1 | B+6.1 QCH1.D 107.95,83.31 88.9,83.31 QCH2.D B+8.1
B-  (via drill 0.81)
  Top 0.61: DRV3.5 131.83,49.53 131.83,49.28 129.29,46.74 C17.- 127,46.74 126.75,46.99 v126.75,48.01 | DRV4.5 132.59,23.11 132.59,21.84 130.3,19.56 C18.- 128.02,18.54 123.7,14.22 B-7.1 | 124.97,38.35 124.97,37.34 124.46,36.83 124.46,34.29 122.17,32 C3.- 121.16,31.5 v117.35,35.31 | 124.97,38.35 123.44,39.88 122.68,39.88 C6.- | 14.35,45.85 15.75,47.24 C9.- | 14.35,45.85 12.19,43.69 12.19,28.7 12.45,28.45 12.45,22.61 11.18,22.61 9.91,21.34 9.91,20.83 R1.1 | 19.68,54.23 18.54,55.37 14.22,55.37 14.22,45.97 14.35,45.85 | 19.68,54.23 20.07,53.85 20.07,53.34 DRV1.5 | DRV2.5 45.97,23.62 45.97,23.37 43.43,20.83 C16.- 43.43,19.3 43.43,14.73 B-2.1 | U$3.2 69.34,36.32 62.99,42.67 49.02,42.67 C22.- | D1.A 73.66,68.83 73.66,71.88 B-3.1 | 19.68,54.23 21.84,56.39 25.4,56.39 25.4,58.67 30.73,64.01 33.53,64.01 33.53,65.28 C13.- | v127.25,40.39 125.22,38.35 124.97,38.35
  Bottom 0.61: 121.92,48.01 v126.75,48.01 | C22.- 47.5,43.18 46.23,44.45 34.29,44.45 | v117.35,35.31 72.9,35.31 U$3.2 | v127.25,40.39 157.99,40.39 157.99,75.18 156.97,76.2 152.91,76.2
  Bottom 2.184: C12.- C14.- | C12.- 34.29,44.45 C10.- | C11.- C10.- | C11.- C13.- 34.29,65.79 36.07,67.56 51.05,67.56 55.12,71.63 B-1.1 | C15.- 36.32,21.08 B-2.1 | B-7.1 121.92,14.22 C4.- 121.92,48.01 C2.- | C7.- C2.- | C7.- C5.- 129.03,66.8 133.86,71.63 B-8.1 | C7.- C2.- | C11.- C10.- | C14.- C15.- | C12.- C14.- | C14.- C15.-
  Bottom 3.81: B-1.1 QAL1.S 55.12,83.31 74.17,83.31 QAL2.S B-3.1 | B-5.1 QDL1.S 141.73,3.3 122.68,3.3 QDL2.S B-7.1 | B-2.1 QBL1.S 43.94,3.3 62.99,3.3 QBL2.S B-4.1 | B-6.1 152.91,76.2 QCL1.S 152.91,83.31 133.86,83.31 QCL2.S B-8.1
BAT1
  Top 0.406: D3.A 161.29,73.91 163.07,72.14 163.07,6.1 160.53,3.56 X1.1
BAT2
  Top 0.406: D4.A 160.78,60.71 159.77,59.69 159.77,27.18 161.8,25.15 161.8,8.64 160.53,7.37 X1.2
BIS  (via drill 0.61)
  Top 0.254: v5.08,54.36 5.08,44.45 SV1.14 | v25.4,54.1 27.43,54.1 28.45,55.12 v36.32,55.12 | v111.25,45.21 112.01,45.21 112.78,44.45 v124.46,44.45
  Bottom 0.254: v5.08,54.36 5.33,54.61 13.72,54.61 14.99,53.34 24.64,53.34 v25.4,54.1 | v36.32,55.12 36.32,45.21 v111.25,45.21 | v124.46,44.45 126.49,46.48 138.43,46.48 139.45,47.5 139.45,52.07 138.18,52.07 U$5.3
COIL1  (via drill 0.81)
  Top 0.61: C22.+ 46.48,42.67 57.91,31.24 69.34,31.24 U$3.1 | D5.C D2.A 156.72,60.71 157.99,59.44 157.99,20.32 156.46,18.8 156.46,16 157.48,14.99 X1.4 X1.3 | v108.97,31.75 118.87,41.66 v130.56,41.66
  Bottom 0.61: v108.97,31.75 73.41,31.75 72.9,31.24 U$3.1 | v130.56,41.66 131.32,42.42 139.19,42.42 156.21,59.44 156.21,60.71 D2.A
GAH
  Top 0.406: 17.53,57.15 14.73,57.15 14.48,57.4 14.48,60.2 15.24,60.96 15.24,64.52 12.19,64.52 5.08,71.63 RG1.1 | 17.53,57.15 17.53,57.91 DRV1.12 | 17.53,57.15 23.37,57.15 23.62,57.4 23.62,60.2 23.37,60.2 22.61,60.96 22.61,71.12 23.11,71.63 RG2.1
GAH1  (via drill 0.61)
  Top 0.406: 101.85,66.04 86.87,66.04 85.85,67.06 85.85,69.6 83.82,71.63 RG9.1 | 101.85,66.04 101.85,71.63 RG10.1 | v129.03,58.42 129.03,57.91 129.29,57.66 DRV3.12 | v123.95,58.42 123.19,58.42 119.38,62.23 101.85,62.23 101.85,66.04
  Bottom 0.406: v123.95,58.42 v129.03,58.42
GAL  (via drill 0.61)
  Top 0.406: RG4.1 62.48,71.63 62.48,71.37 48.77,71.37 48.51,71.63 44.45,71.63 RG3.1 43.43,71.63 35.81,71.63 30.48,66.29 30.48,65.79 v24.64,59.94 | v22.1,55.12 22.1,53.59 21.84,53.34 DRV1.6
  Bottom 0.406: v22.1,55.12 22.1,59.94 v24.64,59.94
GAL1  (via drill 0.61)
  Top 0.406: v126.75,71.63 123.19,71.63 RG11.1 | 137.67,71.37 141.22,71.37 141.22,71.63 RG12.1 | 137.67,71.37 v130.81,71.37 | 137.67,71.37 137.67,60.2 136.4,58.93 136.4,56.39 133.86,53.85 133.86,51.56 133.6,51.31 DRV3.6
  Bottom 0.406: v126.75,71.63 127,71.37 v130.81,71.37
GBH  (via drill 0.61)
  Top 0.406: v22.1,14.99 16.26,14.99 RG5.1 | v25.15,16.26 34.29,16.26 | 34.29,16.26 34.29,14.99 RG6.1 | v43.18,27.69 43.18,29.72 43.43,29.97 DRV2.12 | v38.86,25.65 35.56,22.35 35.56,17.53 34.29,16.26
  Bottom 0.406: v22.1,14.99 23.37,16.26 v25.15,16.26 | v43.18,27.69 41.15,25.65 v38.86,25.65
GBH1
  Top 0.406: 113.03,15.24 101.6,15.24 101.35,14.99 95,14.99 RG13.1 | 113.03,15.24 113.03,14.99 RG14.1 | 113.03,15.24 113.03,20.07 115.57,22.61 115.57,27.69 128.52,27.69 129.79,28.96 129.79,29.21 130.05,29.46 DRV4.12
GBL  (via drill 0.61)
  Top 0.406: RG8.1 73.66,14.99 73.66,15.24 62.23,15.24 61.98,14.99 55.63,14.99 RG7.1 54.61,14.99 54.61,15.75 v51.31,19.05 | v47.75,22.61 47.75,23.62 DRV2.6
  Bottom 0.406: v51.31,19.05 v47.75,22.61
GBL1  (via drill 0.61)
  Top 0.406: v136.4,21.59 136.4,17.02 134.37,14.99 RG15.1 | v134.37,21.84 134.37,23.11 DRV4.6 | v150.88,14.99 152.4,14.99 RG16.1
  Bottom 0.406: v134.37,21.84 136.14,21.84 v136.4,21.59 136.65,21.34 144.53,21.34 v150.88,14.99
GND  (via drill 0.61)
  Top 0.61: UTC.3 153.16,83.82 156.21,83.82 156.21,75.44 D5.A | DRV4.3 130.56,24.13 131.32,24.13 DRV4.4 v131.57,22.35 | DRV3.3 129.79,50.55 130.56,50.55 DRV3.4 131.06,51.31 v131.06,52.32 | 149.86,22.86 149.86,42.42 139.45,52.83 139.45,54.1 138.68,54.86 U$5.4 | 149.86,22.86 149.86,2.79 151.89,2.79 UTD.3 | 149.86,22.86 v149.61,22.86 | DRV2.3 43.94,24.64 44.7,24.64 DRV2.4 45.21,25.4 v45.21,26.42 | 80.77,23.37 80.77,2.79 73.66,2.79 UTB.3 | 80.77,23.37 89.92,32.51 U$3.4 89.92,34.04 84.33,39.62 84.33,50.04 U$1.4 83.57,51.56 81.53,53.59 | v78.23,25.65 80.52,23.37 80.77,23.37 | C21.2 5.08,20.83 5.08,23.37 R8.2 | R6.1 R1.2 10.92,19.81 10.92,19.05 8.38,19.05 8.38,19.81 5.59,19.81 C21.2 | SV1.15 2.54,41.91 2.54,46.99 SV1.9 | DRV1.3 18.03,52.58 18.8,52.58 DRV1.4 19.05,39.62 R4.12 | R4.9 22.86,38.86 21.84,38.86 R4.10 21.59,38.86 20.57,38.86 R4.11 20.32,38.86 19.3,38.86 R4.12 | R4.12 19.05,38.86 18.03,38.86 R4.13 17.78,38.86 16.76,38.86 R4.14 16.51,38.86 15.49,38.86 R4.15 15.24,38.86 14.22,38.86 R4.16 14.22,39.62 14.22,40.89 v13.21,41.91 | v10.16,41.66 10.16,27.69 4.83,27.69 2.29,25.15 2.29,19.05 4.57,19.05 4.83,19.3 4.83,19.81 C21.2 | 81.53,53.59 81.53,59.18 | 81.53,59.18 81.53,84.07 74.42,84.07 UTA.3 | v77.47,49.28 81.53,53.34 81.53,53.59 | 81.53,59.18 95,59.18 102.87,51.31 C19.+ C20.- 109.22,51.31 109.22,52.58 v123.95,52.58 | v29.72,41.91 35.56,41.91 35.56,42.16 v41.66,48.26
  Bottom 0.61: v131.57,22.35 132.08,22.86 v149.61,22.86 | D5.A 156.21,73.91 138.43,56.13 U$5.4 137.16,55.12 133.86,55.12 v131.06,52.32 130.81,52.58 v123.95,52.58 | v45.21,26.42 45.97,25.65 v78.23,25.65 | 10.16,41.91 v13.21,41.91 v29.72,41.91 | 10.16,41.91 5.08,41.91 SV1.15 | v10.16,41.66 10.16,41.91 | v77.47,49.28 45.97,49.28 44.96,50.29 U$2.4 43.69,50.29 v41.66,48.26
INA  (via drill 0.61)
  Top 0.254: v18.03,35.05 18.03,32.77 R4.4 | v8.38,36.07 8.89,36.58 8.89,40.89 8.13,41.66 8.13,55.88 6.86,57.15 4.32,57.15 4.32,57.91 SV1.1 | v15.24,54.36 DRV1.1
  Bottom 0.254: v18.03,35.05 17.02,36.07 v8.38,36.07 | v15.24,54.36 12.45,57.15 5.08,57.15 SV1.1
INB  (via drill 0.61)
  Top 0.254: v17.02,34.04 17.02,33.02 16.76,32.77 R4.3 | v29.72,34.04 30.23,34.04 31.5,32.77 40.39,32.77 40.39,25.91 40.89,25.4 DRV2.1 | v2.03,34.29 1.27,35.05 1.27,53.34 SV1.3
  Bottom 0.254: v29.72,34.04 v17.02,34.04 16.76,33.78 2.54,33.78 v2.03,34.29
INC  (via drill 0.61)
  Top 0.254: v18.29,30.73 19.05,31.5 R4.5 | v9.14,31.75 7.87,33.02 v7.87,34.8 | v123.95,55.12 113.03,55.12 v113.03,55.63 | v36.32,60.2 30.99,60.2 30.99,59.69 v29.72,58.42 | v127,54.86 DRV3.1
  Bottom 0.254: v18.29,30.73 17.27,31.75 v9.14,31.75 | v7.87,34.8 7.37,34.29 3.3,34.29 2.03,35.56 2.03,52.83 3.3,52.83 SV1.5 3.3,53.85 2.54,53.85 2.54,58.93 3.3,59.69 12.45,59.69 12.45,77.98 14.99,80.52 17.27,80.52 17.27,77.98 29.72,65.53 v29.72,58.42 | v127,54.86 126.75,55.12 v123.95,55.12 | v113.03,55.63 108.46,60.2 v36.32,60.2
IND  (via drill 0.61)
  Top 0.254: 19.81,20.07 18.03,18.29 1.52,18.29 1.52,32.51 3.05,34.04 3.05,34.54 1.78,35.81 1.78,48.77 SV1.7 | 19.81,20.07 21.59,21.84 21.59,31.5 R4.7 | v125.98,23.62 127.51,23.62 DRV4.1 | v116.59,23.62 v123.95,23.62 | v49.28,18.03 45.72,14.48 45.72,7.11 44.7,6.1 25.91,6.1 25.91,13.97 19.81,20.07
  Bottom 0.254: v123.95,23.62 v125.98,23.62 | v116.59,23.62 114.3,21.34 54.86,21.34 51.56,18.03 v49.28,18.03
LM61PWR  (via drill 0.61)
  Top 0.254: 151.13,27.69 154.43,24.38 154.43,6.1 153.42,5.08 UTD.1 | 151.13,27.69 151.13,81.03 151.64,81.53 UTC.1 | C21.1 3.56,20.83 3.56,23.37 R8.1 4.06,24.38 4.06,25.15 6.1,25.15 6.35,24.89 6.35,24.38 9.14,24.38 R7.1 10.16,24.38 v10.16,25.4 | UTB.1 74.68,5.08 76.2,6.6 v76.2,24.64 76.2,79.25 73.66,81.79 UTA.1 | v29.72,25.15 v36.83,25.15 | v150.88,27.69 151.13,27.69 | v116.59,25.4 v123.95,25.4
  Bottom 0.254: v10.16,25.4 10.41,25.15 v29.72,25.15 | v36.83,25.15 37.34,24.64 v76.2,24.64 92.96,24.64 93.73,23.88 115.06,23.88 v116.59,25.4 | v150.88,27.69 148.59,25.4 v123.95,25.4
LMIS  (via drill 0.61)
  Top 0.254: v12.19,46.99 13.21,48.01 v13.21,53.09 | v25.4,52.83 27.69,52.83 27.69,53.09 28.7,54.1 v50.8,54.1 | v83.06,54.1 85.85,51.31 U$1.3
  Bottom 0.254: v12.19,46.99 7.62,46.99 SV1.12 | v13.21,53.09 13.46,52.83 v25.4,52.83 | v50.8,54.1 v83.06,54.1
MA1  (via drill 0.81)
  Top 0.61: DRV3.11 130.81,60.71 CVB3.- 129.79,62.74 128.78,63.75 128.78,71.88 MC4.1
  Top 1.016: 113.54,73.66 113.03,73.66 114.3,72.39 v114.3,64.26
  Top 3.81: MC1.1 113.54,73.66 QCH1.S 113.54,83.31 94.49,83.31 | MC2.1 QCH2.S 94.49,83.31 | 147.32,83.31 QCL1.D MC3.1 | 94.49,83.31 147.32,83.31 | MC4.1 QCL2.D 128.27,83.31 147.32,83.31
  Bottom 1.016: R5.1 v114.3,64.26
MB
  Top 0.61: 44.96,32.51 44.96,34.29 CVB2.- | 44.96,32.51 DRV2.11 | 44.96,32.51 50.29,32.51 50.29,14.48 MB3.1
  Top 3.81: MB1.1 4.57,3.3 23.62,3.3 | 23.62,3.3 MB2.1 | 49.53,3.3 MB3.1 | 23.62,3.3 49.53,3.3 | MB4.1 68.58,3.3 49.53,3.3
  Bottom 0.813: MB2.1 24.13,13.46 26.67,16 C1.2
  Bottom 3.81: MB1.1 QBH1.S | 23.62,8.64 QBH2.S MB2.1 | 49.53,8.64 QBL1.D MB3.1 | 68.58,8.64 QBL2.D MB4.1
MB1
  Top 0.61: CVB4.- 131.57,34.04 DRV4.11 131.83,29.46 131.83,28.96 133.35,27.43 146.81,27.43 146.81,14.73 MD3.1
  Top 3.81: MD1.1 QDH1.S 102.36,3.3 83.31,3.3 | 83.31,3.3 QDH2.S MD2.1 | MD3.1 QDL1.D 147.32,3.3 136.14,3.3 | 83.31,3.3 136.14,3.3 | 128.27,8.64 128.27,3.3 136.14,3.3 | 128.27,8.64 QDL2.D | 128.27,8.64 MD4.1
  Bottom 0.813: MD1.1 102.87,13.46 109.22,19.81 C8.2
  Bottom 3.81: MD2.1 83.31,8.89 | MD1.1 102.36,8.89 | 128.27,8.64 QDL2.D MD4.1 | MD3.1 147.32,8.89
N$1
  Top 0.61: R11.2 D2.C
N$2
  Bottom 0.813: C1.1 R3.2
N$4
  Bottom 0.813: C8.1 R5.2
N$7
  Bottom 0.406: R10.2 155.96,26.92 159.77,30.73 160.53,30.73 R9.1
N$8
  Top 0.406: R9.2 D4.C 161.29,52.07 162.31,53.09 162.31,62.74 161.29,63.75 D3.C
N$10
  Top 0.61: R10.1 160.53,18.8 X1.5
Q1G
  Top 0.406: RG1.2 QAH1.G
Q1G1
  Top 0.406: RG10.2 QCH1.G
Q2G
  Top 0.406: RG2.2 Q2.G
Q2G1
  Top 0.406: RG9.2 QCH2.G
Q3G
  Top 0.406: RG3.2 QAL1.G
Q3G1
  Top 0.406: RG12.2 QCL1.G
Q4G
  Top 0.406: RG4.2 QAL2.G
Q4G1
  Top 0.406: RG11.2 QCL2.G
Q5G
  Top 0.406: QBH1.G RG5.2
Q5G1
  Top 0.406: QDH1.G RG14.2
Q6G
  Top 0.406: QBH2.G RG6.2
Q6G1
  Top 0.406: QDH2.G RG13.2
Q7G
  Top 0.406: QBL1.G RG7.2
Q7G1
  Top 0.406: QDL1.G RG16.2
Q8G
  Top 0.406: QBL2.G RG8.2
Q8G1
  Top 0.406: QDL2.G RG15.2
QAH2
  Top 0.61: Q2.S MA2.1 | DRV1.11 19.05,62.48 CVB1.- 18.8,64.52 16.26,67.06 16.26,71.88 MA1.1 QAH1.S | QAL1.D MA3.1 | QAL2.D MA4.1
  Top 3.81: 34.8,83.31 Q2.S | 49.53,83.31 QAL1.D | 34.8,83.31 49.53,83.31 | QAL2.D 68.58,83.31 49.53,83.31 | QAH1.S 15.75,83.31 34.8,83.31
  Bottom 0.813: R3.1 26.67,66.8 19.05,74.42 MA1.1
RMIS  (via drill 0.61)
  Top 0.254: v26.92,39.88 28.7,41.66 28.7,47.75 33.27,52.32 46.48,52.32 46.48,51.56 U$2.3
  Bottom 0.254: v26.92,39.88 26.67,40.13 25.65,40.13 24.89,39.37 2.54,39.37 2.54,41.15 3.3,41.91 3.3,42.67 SV1.13
TEMPA  (via drill 0.61)
  Top 0.254: v25.91,39.12 25.91,40.13 28.19,42.42 28.19,52.83 50.8,52.83 70.87,72.9 70.87,83.31 74.17,83.31 74.68,82.8 UTA.2
  Bottom 0.254: v25.91,39.12 25.65,38.86 7.11,38.86 SV1.18
TEMPB  (via drill 0.61)
  Top 0.254: v62.74,28.19 75.69,15.24 75.69,6.86 74.93,6.1 73.91,6.1 72.9,5.08 UTB.2 | v28.96,28.7 v37.08,28.7 | v8.38,28.7 5.08,32 5.08,36.83 SV1.17
  Bottom 0.254: v62.74,28.19 62.23,28.7 v37.08,28.7 | v28.96,28.7 27.43,30.23 25.65,30.23 24.13,28.7 v8.38,28.7
TEMPC  (via drill 0.61)
  Top 0.254: v154.69,59.44 154.69,81.03 154.18,81.53 UTC.2 | v116.84,43.18 v123.95,43.18 | v36.32,41.15 30.23,41.15 30.23,40.64 27.18,37.59 v27.18,32.51 | v9.14,29.72 6.86,32 6.86,35.05 SV1.20
  Bottom 0.254: v154.69,59.44 138.43,43.18 v123.95,43.18 | v116.84,43.18 114.81,41.15 v36.32,41.15 | v27.18,32.51 24.38,29.72 v9.14,29.72
TEMPD  (via drill 0.61)
  Top 0.254: v150.88,12.45 150.88,5.08 UTD.2 | v127,20.57 124.97,22.61 124.97,25.65 123.95,26.67 v116.59,26.67 | v36.32,29.72 33.78,32.26 v28.7,32.26 | v4.06,32.77 4.06,35.05 SV1.19
  Bottom 0.254: v150.88,12.45 142.75,20.57 v127,20.57 | v116.59,26.67 114.05,29.21 37.85,29.21 37.34,29.72 v36.32,29.72 | v28.7,32.26 27.43,33.53 17.78,33.53 17.02,32.77 v4.06,32.77
VB1  (via drill 0.61)
  Top 0.61: 16.76,61.47 16.76,59.69 DRV1.13 | 16.76,61.47 16.76,62.99 DB1.C | v23.62,61.47 23.62,62.48 CVB1.+ | 16.76,61.47 v17.02,61.47
  Bottom 0.61: v17.02,61.47 v23.62,61.47
VB2
  Top 0.61: DRV2.13 42.16,31.75 42.16,34.8 DB2.C 42.16,35.81 42.93,36.58 42.93,38.1 46.74,38.1 48.51,36.32 CVB2.+
VB3  (via drill 0.61)
  Top 0.61: 128.02,60.2 128.02,57.66 DRV3.13 | 128.02,60.2 128.02,61.21 DB3.C | v132.84,60.71 134.62,60.71 CVB3.+ | 128.02,60.2 v128.27,60.2
  Bottom 0.61: v132.84,60.71 132.33,60.2 v128.27,60.2
VB4
  Top 0.61: DRV4.13 128.78,31.24 128.78,34.54 DB4.C 129.29,35.56 129.29,36.07 130.05,36.83 130.05,37.85 133.6,37.85 135.38,36.07 CVB4.+
VBATSENSE  (via drill 0.61)
  Top 0.254: R6.2 17.27,20.83 17.27,21.34 16.76,21.84 16.76,23.62 R2.1 15.75,24.64 15.75,26.16 12.95,28.96 12.95,40.13 v13.21,40.39
  Bottom 0.254: v13.21,40.39 6.86,40.39 SV1.16